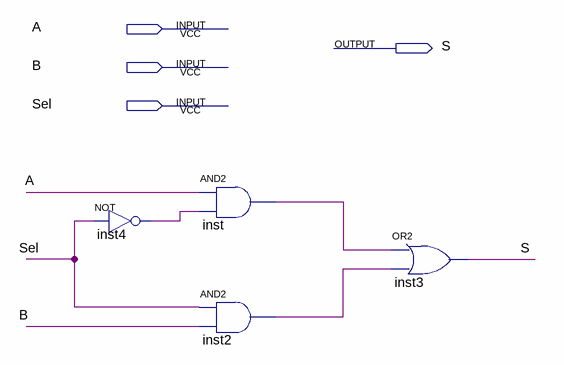
[diagram p0: schematic sheet]
// Quartus schematic MUX_21.bdf as structural Verilog: 4 symbols, 4 pins
module MUX_21 (
  input  A,
  input  B,
  input  Sel,
  output S
);

  wire inst2_out, inst4_out, inst_out;

  not inst4 (inst4_out, Sel);
  and inst (inst_out, A, inst4_out);
  and inst2 (inst2_out, Sel, B);
  or inst3 (S, inst_out, inst2_out);
endmodule
